# Altium schematic sheet door v3.SchDoc
size A3; SheetNumber: 1; SheetTotal: 1
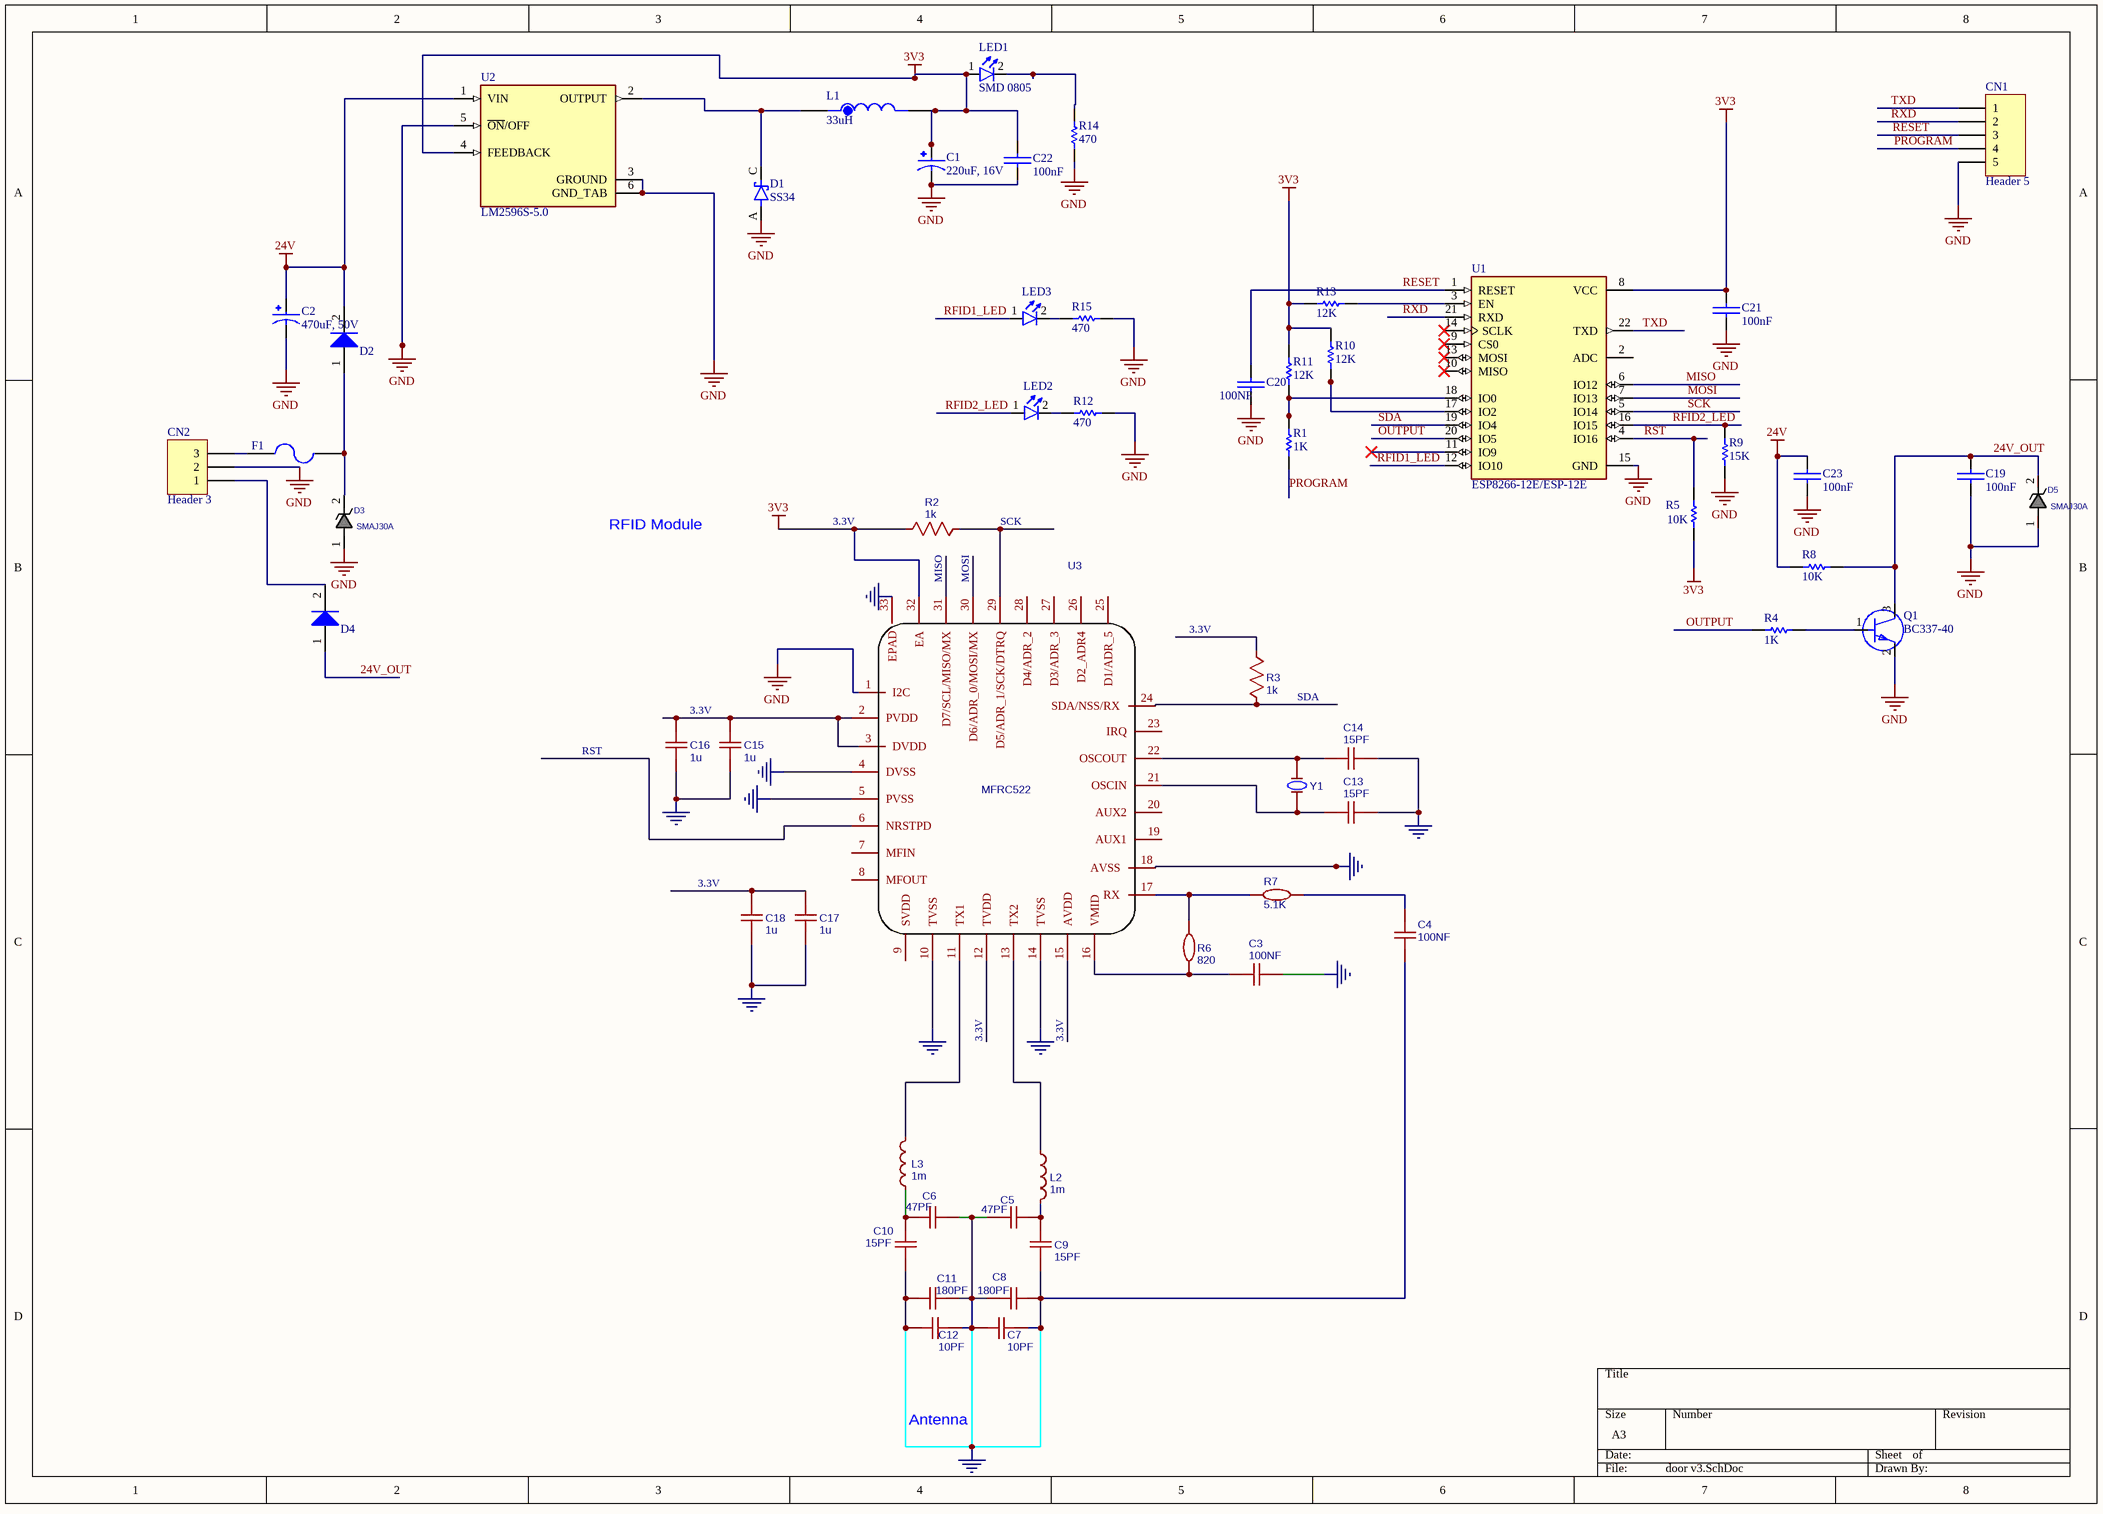
[diagram p0: door v3.SchDoc]

## Parts
C1  220uF, 16V  [CAP_EEEFN0J681L]
C2  470uF, 50V  [CAP_EEEFN1V471UV]
C3  100NF  [0805C]
C4  100NF  [0805C]
C5  47PF  [0805C]
C6  47PF  [0805C]
C7  10PF  [0805C]
C8  180PF  [0805C]
C9  15PF  [0805C]
C10  15PF  [0805C]
C11  180PF  [0805C]
C12  10PF  [0805C]
C13  15PF  [0805C]
C14  15PF  [0805C]
C15  1u  [0805C]
C16  1u  [0805C]
C17  1u  [0805C]
C18  1u  [0805C]
C19  100nF  [0805C]
C20  100NF  [0805C]
C21  100nF  [0805C]
C22  100nF  [0805C]
C23  100nF  [0805C]
CN1  Header 5  [HDR1X5]
CN2  Header 3  [MSTB 2,5/3-G-5,08]
D1  SS34  [DIOM7959X265N]
D2  1n4007  [DIOM4629X24N]  (value not drawn)
D3  SMAJ30A  [SMA DIODE]
D4  1n4007  [DIOM4629X24N]  (value not drawn)
D5  SMAJ30A  [SMA DIODE]
F1  F=1.0 A  [1206 FUSE]  (value not drawn)
L1  33uH  [IND_DRC-V-822K]
L2  1m  [IND1206]
L3  1m  [IND1206]
LED1  Size: SMD 0805  [LED_0805]  (hidden comment: Red)
LED2  Red  [LED_0805]  (value not drawn)
LED3  Red  [LED_0805]  (value not drawn)
Q1  BC337-40  [SOT23]
R1  1K  [0805]
R2  1k  [0805]
R3  1k  [0805]
R4  1K  [0805]
R5  10K  [0805]
R6  820  [0805]
R7  5.1K  [0805]
R8  10K  [0805]
R9  15K  [0805]
R10  12K  [0805]
R11  12K  [0805]
R12  470  [0805]
R13  12K  [0805]
R14  470  [0805]
R15  470  [0805]
U1  ESP8266-12E/ESP-12E  [XCVR_ESP8266-12E/ESP-12E]
U2  LM2596S-5.0  [TO170P1524X483-6N]
U3  MFRC522  [HVQFN32]
Y1  XTALfast  [XTAL]  (value not drawn)

## Nets
3.3V: C1.1 C15.2 C16.2 C17.2 C18.2 C21.1(+) C22.1(+) L1.2 LED1.1(A) R2.2 R3.1 R5.1 R10.2 R11.2 R13.2 U1.8(VCC) U2.4(FEEDBACK) U3.2(PVDD) U3.3(DVDD) U3.12(TVDD) U3.15(AVDD) U3.32(EA)  [also labelled 3V3]
24V: C2.1 C23.1(+) D2.2(K) R8.1 U2.1(VIN)
GND: C1.2 C2.2 C3.2 C4.1 C5.2 C6.1 C7.1 C7.2 C8.1 C8.2 C9.1 C10.1 C11.1 C11.2 C12.1 C12.2 C13.2 C14.2 C15.1 C16.1 C17.1 C18.1 C19.2(-) C20.2(-) C21.2(-) C22.2(-) C23.2(-) CN1.5 CN2.2 D1.A D3.1 D5.1 Q1.2(E) R9.1 R12.1 R14.1 R15.1 U1.15(GND) U2.3(GROUND) U2.5(~{ON}/OFF) U2.6(GND_TAB) U3.1(I2C) U3.4(DVSS) U3.5(PVSS) U3.10(TVSS) U3.14(TVSS) U3.18(AVSS) U3.33(EPAD)
24V_OUT: C19.1(+) D4.1(A) D5.2 Q1.3(C) R8.2
MISO: U1.6(IO12) U3.31(D7/SCL/MISO/MX)
MOSI: U1.7(IO13) U3.30(D6/ADR_0/MOSI/MX)
OUTPUT: R4.2 U1.20(IO5)
PROGRAM: CN1.4 R1.1
RESET: C20.1(+) CN1.3 U1.1(RESET)
RFID1_LED: LED3.1(A) U1.12(IO10)
RFID2_LED: LED2.1(A) R9.2 U1.16(IO15)
RST: R5.2 U1.4(IO16) U3.6(NRSTPD)
RXD: CN1.2 U1.21(RXD)
SCK: R2.1 U1.5(IO14) U3.29(D5/ADR_1/SCK/DTRQ)
SDA: R3.2 U1.19(IO4) U3.24(SDA/NSS/RX)
TXD: CN1.1 U1.22(TXD)
NetC3_1: C3.1 R6.1 U3.16(VMID)
NetC4_2: C4.2 R7.1
NetC5_1: C5.1 C9.2 L2.2
NetC6_2: C6.2 C10.2 L3.1
NetC13_1: C13.1 U3.21(OSCIN) Y1.1(OSC1)
NetC14_1: C14.1 U3.22(OSCOUT) Y1.2(OSC2)
NetCN2_1: CN2.1 D4.2(K)
NetCN2_3: CN2.3 F1.1
NetD1_C: D1.C(K) L1.1 U2.2(OUTPUT)
NetD2_1: D2.1(A) D3.2 F1.2
NetL2_1: L2.1 U3.13(TX2)
NetL3_2: L3.2 U3.11(TX1)
NetLED1_2: LED1.2(K) R14.2
NetLED2_2: LED2.2(K) R12.2
NetLED3_2: LED3.2(K) R15.2
NetQ1_1: Q1.1(B) R4.1
NetR1_2: R1.2 R11.1 U1.18(IO0)
NetR6_2: R6.2 R7.2 U3.17(RX)
NetR10_1: R10.1 U1.17(IO2)
NetR13_1: R13.1 U1.3(EN)

Not connected (* = marked no-connect by the designer): U1 2(ADC) 9(CS0)* 10(MISO)* 11(IO9)* 13(MOSI)* 14(SCLK)*; U3 7(MFIN) 8(MFOUT) 9(SVDD) 19(AUX1) 20(AUX2) 23(IRQ) 25(D1/ADR_5) 26(D2_ADR4) 27(D3/ADR_3) 28(D4/ADR_2)

## Notes on the sheet
- RFID Module
- Antenna

## Library data of the parts
C1 C2 = EEEFN0J681L: CAP ALUM 680UF 20% 6.3V SMD; MF: Panasonic; Value: *; SnapEDA_Link: https://www.snapeda.com/parts/EEEFN0J681L/Panasonic/view-part/5795570/?ref=snap; Purchase-URL: https://pricing.snapeda.com/search/part/EEEFN0J681L/?ref=eda; Check_prices: https://www.snapeda.com/parts/EEEFN0J681L/Panasonic/view-part/5795570/?ref=eda; Availability: In Stock; Price: None; MP: EEEFN0J681L; Package: RADIAL-2 Panasonic
C3-C18 = 1u: nameAlias: Value(F); BOM_Manufacturer Part: ?; spicePre: C; spiceSymbolName: Capacitor
C19-C23 = Cap-Bipolar: Bipolar Capacitor; Voltage: 100V; Designer: Saeid Jorablo; Organazation: ControTec; Adding Date: 1387/12/20
  C19 C21-C23: Value: 100nF
CN1 = Header 5: Header, 5-Pin; LatestRevisionDate: 17-Jul-2002; LatestRevisionNote: Re-released for DXP Platform.; Publisher: Altium Limited
CN2 = Header 3: Header, 3-Pin; LatestRevisionDate: 17-Jul-2002; LatestRevisionNote: Re-released for DXP Platform.; Publisher: Altium Limited
D1 = SS34: Diode Schottky 40V 3A 2-Pin SMC T/R; Price: None; MP: SS34; Value: *; Availability: Unavailable; Package: None
D2 D4 = 1n4007 SMD M7: Standard Rectifiers; Part. No: M7; Manufacturer: DC COMPONENTS; Designer: Abbas Basereh; Link: http://www.tme.eu/en/details/m7/smd-universal-diodes/dc-components/; Link: https://www.aliexpress.com/item/Smd-tube-1n4007-m7-SMA/1213719741.html?spm=2114.01010208.3.1.ZyZ7bC&ws_ab_test=searchweb0_0,searchweb201602_4_10065_10068_10084_10083_10080_10082_10081_10060_10061_10062_10056_10055_10054_10059_10099_10078_10079_427_10073_10103_10102_10096_10052_10050_10051,searchweb201603_4&btsid=db2be5ca-e560-400a-b91c-484ab5ee228b; Data: 16-12-2016
D3 D5 = TVS_SD12: TVS, ESD PROTECT, 12VRWM, 30KV; MANF_P#: SD12-01FTG, SD12C-01FTG; MANF: Littelfuse; VALUE: SMAJ12A; PARAM2: 12VRWM, 30KV; PRICE: 0.5$
F1 = Fuse SMD1206: SMD Fuses 1206; Designer: Abbas Basereh; Desc.: SMD Fuses 1206; Data: 16-12-2016
L1 = DRC-V-822K: Radial Inductor with Leads,8200ÂµH, 0.13A,Q>20; MF: Bel Fuse; MP: DRC-V-822K; Purchase-URL: https://pricing.snapeda.com/search/part/DRC-V-822K/?ref=eda; SnapEDA_Link: https://www.snapeda.com/parts/DRC-V-822K/Bel+Fuse/view-part/?ref=snap; Value: *; Package: None; Price: None; Availability: In Stock; Check_prices: https://www.snapeda.com/parts/DRC-V-822K/Bel+Fuse/view-part/?ref=eda
L2 L3 = 1m: nameAlias: Value(H); BOM_Manufacturer Part: ?; spicePre: L; spiceSymbolName: Inductor
LED1-LED3 = LED: Designer: Eng. Saeid Jorablo; Company: SJ Libraries; ComponentLink1Description: Datasheet; ComponentLink2Description: Reference; Publisher: SJ Unlimited; Mounting Technology: Surface Mount\Through-Hole; Color: Red; HelpURL: http://s3.picofile.com/file/7443264187/Coming_Soon_logo.gif; Status: Unreleased
  LED2 LED3: Size: SMD 1206
Q1 = BC337: SMALL SIGNAL BIPOLAR TRANSISTOR; MF: NXP Semiconductors; Package: None; MP: BC337; Price: None; Availability: Unavailable; Value: *; SnapEDA_Link: https://www.snapeda.com/parts/BC337/NXP%20Semiconductors/view-part/4794401/?ref=snap
R1 R4 R5 R8-R15 = RES 1206 0.25W: RES 1206; Designer: Abbas Basereh; Desc.: RES SMD 1206; Data: 16-12-2016
R2 R3 R6 R7 = 1k: nameAlias: Value(Ω); BOM_Manufacturer Part: ?; spicePre: R; spiceSymbolName: Resistor
U1 = ESP8266-12E/ESP-12E: ESP-12E WiFi Module; Value: *; MP: ESP8266-12E/ESP-12E; Availability: Unavailable; Package: None; Price: None
U3 = MFRC522: Contributor: GerryChen; sourceId: wB71jBvNH; BOM_Manufacturer Part: ?; spicePre: U
Y1 = XTALfast: nameAlias: Model; Fseries(Hz): 10Meg; C0val(F): 3p; C1val(F): 10.6f; R1val(Ω): 50; spicePre: X; BOM_Manufacturer Part: ?; spiceSymbolName: XTALfast
U2 = LM2596S-5.0: Value: *; MP: LM2596S-5.0; Package: None; Availability: Unavailable; Price: None